# Altium schematic sheet CFcard.SchDoc
size A4; Revision: A.1(PCB.SCH)
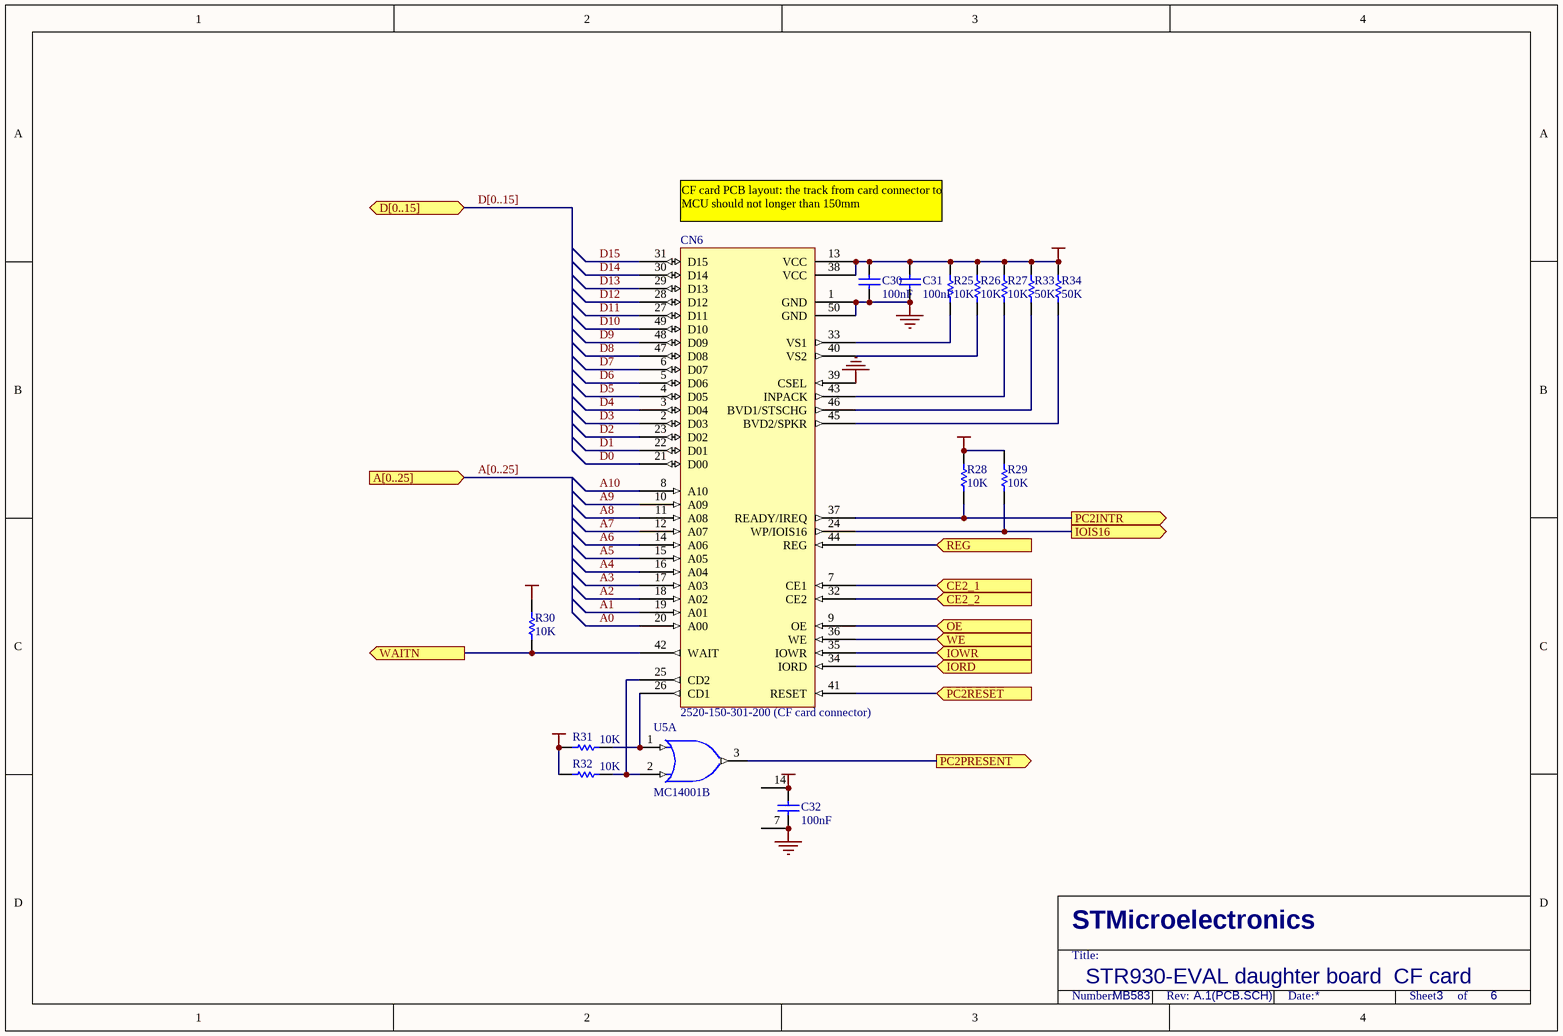
[diagram p0: CFcard.SchDoc]

## Parts
C30  100nF  [0603]
C31  100nF  [0603]
C32  100nF  [0603]
CN6  2520-150-301-200 (CF card connector)
R25  10K  [0603]
R26  10K  [0603]
R27  10K  [0603]
R28  10K  [0603]
R29  10K  [0603]
R30  10K  [0603]
R31  10K  [0603]
R32  10K  [0603]
R33  50K  [0603]
R34  50K  [0603]
U5  MC14001B  (part A of 4)

## Ports
A[0..25] (in), CE2_1 (in), CE2_2 (in), D[0..15] (bidir), IOIS16 (out), IORD (in), IOWR (in), OE (in), PC2INTR (out), PC2PRESENT (out), PC2RESET (in), REG (in), WAITN (out), WE (in)

## Nets
+3V3: C30.2 C31.2 C32.1 CN6.13(VCC) CN6.38(VCC) R25.1 R26.1 R27.1 R28.2 R29.2 R30.2 R31.1 R32.1 R33.1 R34.1 U5.14(VCC)  [also labelled VCC]
GND: C30.1 C31.1 C32.2 CN6.1(GND) CN6.39(CSEL) CN6.50(GND) U5.7(GND)
A0: CN6.20(A00)
A1: CN6.19(A01)
A2: CN6.18(A02)
A3: CN6.17(A03)
A4: CN6.16(A04)
A5: CN6.15(A05)
A6: CN6.14(A06)
A7: CN6.12(A07)
A8: CN6.11(A08)
A9: CN6.10(A09)
A10: CN6.8(A10)
CE2_1: CN6.7(CE1) ; port CE2_1
CE2_2: CN6.32(CE2) ; port CE2_2
D0: CN6.21(D00)
D1: CN6.22(D01)
D2: CN6.23(D02)
D3: CN6.2(D03)
D4: CN6.3(D04)
D5: CN6.4(D05)
D6: CN6.5(D06)
D7: CN6.6(D07)
D8: CN6.47(D08)
D9: CN6.48(D09)
D10: CN6.49(D10)
D11: CN6.27(D11)
D12: CN6.28(D12)
D13: CN6.29(D13)
D14: CN6.30(D14)
D15: CN6.31(D15)
IOIS16: CN6.24(WP/IOIS16) R29.1 ; port IOIS16
IORD: CN6.34(IORD) ; port IORD
IOWR: CN6.35(IOWR) ; port IOWR
OE: CN6.9(OE) ; port OE
PC2INTR: CN6.37(READY/IREQ) R28.1 ; port PC2INTR
PC2PRESENT: U5.3(Y) ; port PC2PRESENT
PC2RESET: CN6.41(RESET) ; port PC2RESET
REG: CN6.44(REG) ; port REG
WAITN: CN6.42(WAIT) R30.1 ; port WAITN
WE: CN6.36(WE) ; port WE
NetCN6_25: CN6.25(CD2) R32.2 U5.2(B)
NetCN6_26: CN6.26(CD1) R31.2 U5.1(A)
NetCN6_33: CN6.33(VS1) R25.2
NetCN6_40: CN6.40(VS2) R26.2
NetCN6_43: CN6.43(INPACK) R27.2
NetCN6_45: CN6.45(BVD2/SPKR) R34.2
NetCN6_46: CN6.46(BVD1/STSCHG) R33.2

## Buses and harness runs
bus A[0..25] = port A[0..25]
bus D[0..15] = port D[0..15]

## Notes on the sheet
- CF card PCB layout: the track from card connector to MCU should not longer than 150mm
- STR930-EVAL daughter board  CF card
- MB583
- 3
- 6
- STMicroelectronics
- Title:
- Number:
- Rev:
- Date:
- Sheet       of

## Library data of the parts
C30-C32 = cap: Capacitor; Value: 100pF; Published: 8-Jun-2000; Revision: July-2002: Re-released for DXP Platform.; Publisher: Altium Limited
CN6 = 2520-150-301-200: CF card connector
R25-R34 = Res1: Resistor; Value: 1K; Published: 8-Jun-2000; Revision: July-2002: Re-released for DXP Platform.; Publisher: Altium Limited
U5 = 74AC32B: Quad 2-Input OR Gate; Package Information: Latest Revision: Jan-1997; Published: 8-Jun-2000; Revision: 17-Jul-2002: Re-released for DXP Platform.; Datasheet: Latest Revision: Apr-1997; Package Reference: DIP14; Publisher: Altium Limited